# EAGLE design Pi_Tracker2 (EAGLE 6.5.0)
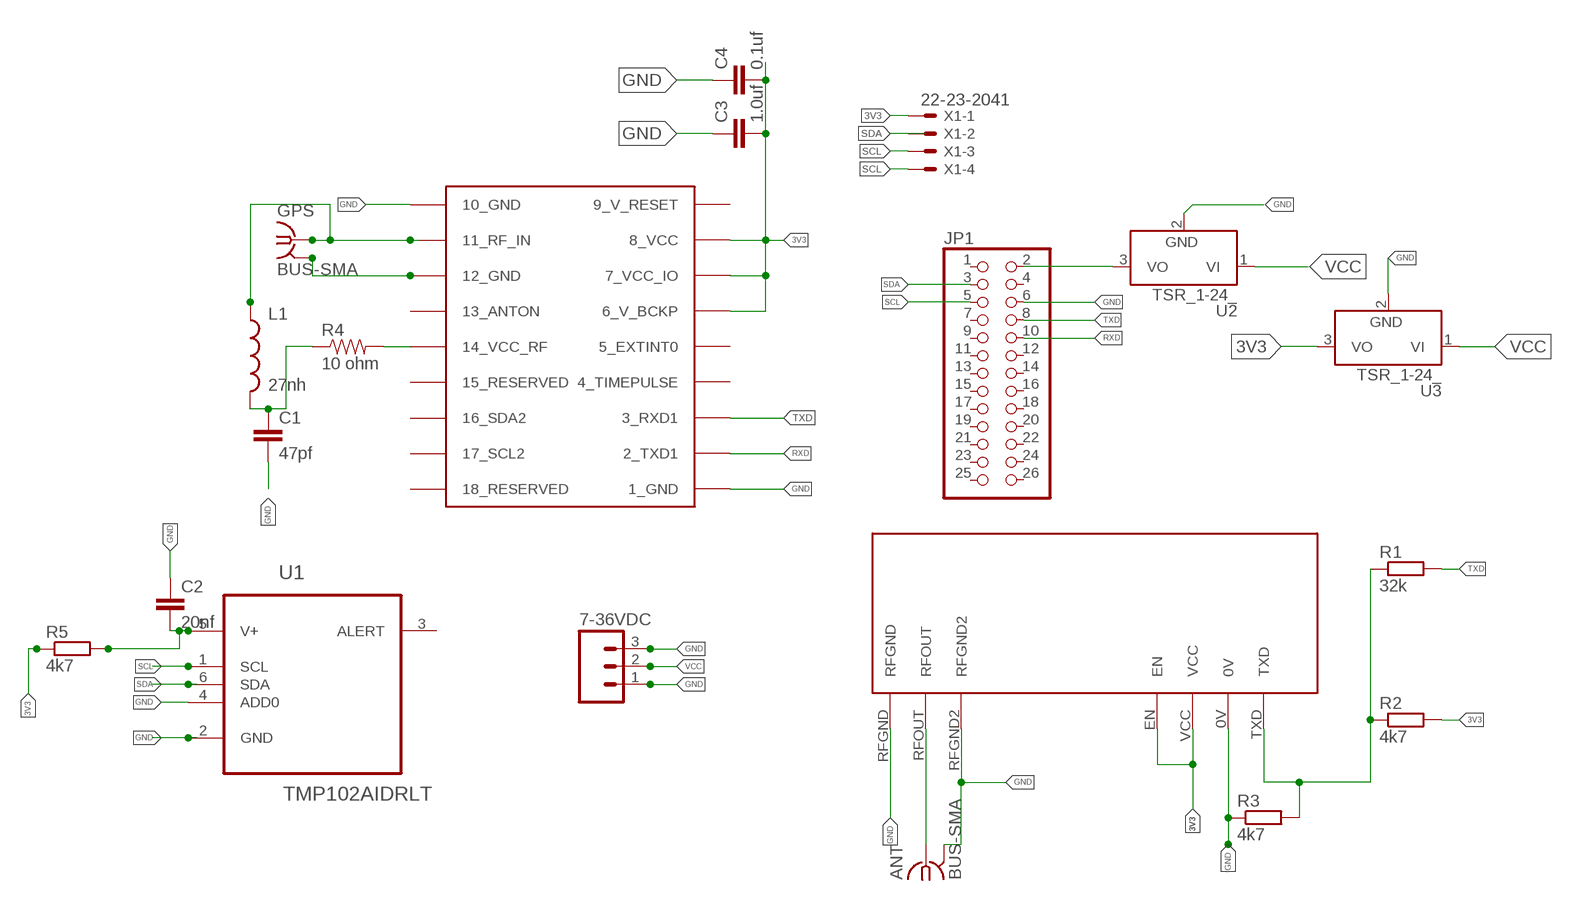
[diagram p0: schematic, sheet 1]

## Parts
7-36VDC  M03PTH  [1X03]
ANT  BUS-SMA  [BUS-SMA]
C1  47pf  CAP0603-CAP  [0603-CAP]
C2  20nf  C-EUC0603  [C0603]
C3  1.0uf  C-EUC0603  [C0603]
C4  0.1uf  C-EUC0603  [C0603]
GPS  BUS-SMA  [BUS-SMA]
JP1  PINHD-2X13  [2X13]
L1  27nh  INDUCTOR0603  [0603]
R1  32k  R-EU_R0603  [R0603]
R2  4k7  R-EU_R0603  [R0603]
R3  4k7  R-EU_R0603  [R0603]
R4  10 ohm  RESISTOR0603  [0603-RES]
R5  4k7  R-EU_R0603  [R0603]
U1  TMP102AIDRLT  [SOT50P160X60-6N]
U2  TSR_1-24_  [TSR-1]
U3  TSR_1-24_  [TSR-1]
U$1  NTX2  [NTX2]
U$2  UBLOX_MAX  [UBLOX_MAX]
X1  22-23-2041  [22-23-2041]

## Nets
3V3: C2.2 C3.2 C4.2 R2.2 R5.1 R5.2 U1.5(V+) U3.3(VO) U$1.EN U$1.VCC U$2.6_V_BCKP U$2.7_VCC_IO U$2.8_VCC X1.1
GND: 7-36VDC.1 7-36VDC.3 ANT.2(GND) ANT.3(GND) ANT.4(GND) ANT.5(GND) C1.2 C2.1 C3.1 C4.1 GPS.2(GND) GPS.3(GND) GPS.4(GND) GPS.5(GND) JP1.6 R3.1 U1.2(GND) U1.4(ADD0) U2.2(GND) U3.2(GND) U$1.0V U$1.RFGND U$1.RFGND2 U$2.1_GND U$2.10_GND U$2.12_GND X1.4
N$2: R4.2 U$2.14_VCC_RF
N$3: C1.1 L1.2 R4.1
N$6: R1.1 R2.1 R3.2 U$1.TXD
N$7: JP1.2 U2.3(VO)
N$9: ANT.1 U$1.RFOUT
N$13: GPS.1 L1.1 U$2.11_RF_IN
RXD: JP1.10 U$2.2_TXD1
SCL: JP1.5 U1.1(SCL) X1.3
SDA: JP1.3 U1.6(SDA) X1.2
TXD: JP1.8 R1.2 U$2.3_RXD1
VCC: 7-36VDC.2 U2.1(VI) U3.1(VI)
Unconnected: JP1.1 JP1.4 JP1.7 JP1.9 JP1.11 JP1.12 JP1.13 JP1.14 JP1.15 JP1.16 JP1.17 JP1.18 JP1.19 JP1.20 JP1.21 JP1.22 JP1.23 JP1.24 JP1.25 JP1.26 U1.3(ALERT) U$2.4_TIMEPULSE U$2.5_EXTINT0 U$2.13_ANTON U$2.15_RESERVED U$2.16_SDA2 U$2.17_SCL2 U$2.18_RESERVED

## Power pins joined to a net without a drawn wire
9_V_RESET: U$2.9_V_RESET

## Library data of the parts
7-36VDC = SparkFun-Connectors:M03: Header 3 Standard 3-pin 0.1" header. Use with straight break away headers (SKU : PRT-00116), right angle break away headers (PRT-00553), swiss pins (PRT-00743), machine pins (PRT-00117), and female headers (PRT-00115). Molex polarized connector foot print use with SKU : PRT-08232 with associated crimp pins and housings.
ANT GPS = Ava:BUS-SMA
C1 = SparkFun-Capacitors:CAP: Capacitor Standard 0603 ceramic capacitor, and 0.1" leaded capacitor.
C2-C4 = rcl:C-EU: CAPACITOR, European symbol
JP1 = pinhead:PINHD-2X13: PIN HEADER
L1 = SparkFun-Passives:INDUCTOR: Inductors Basic Inductor/Choke - 0603 and 1206. Footprints are not proven and vary greatly between part numbers. SRN6045- 33uH, 20% 1.4A SDR0403-560KL - 56uH, 10%, 500mA RMS/740mA peak
R1-R3 R5 = rcl:R-EU_: RESISTOR, European symbol
R4 = SparkFun-Resistors:RESISTOR: Resistor Basic schematic elements and footprints for 0603, 1206, and PTH resistors.
U1 = Ava:TMP102AIDRLT: Temperature Sensor; MPN: TMP102AIDRLT; OC_FARNELL: 1652477; OC_NEWARK: 53M3987; PACKAGE: SOT-23-6; SUPPLIER: Texas Instruments
U2 U3 = traco_tsr-1:TSR_1-*: TRACO TSR-1 Series Point-of-Load DC/DC-Converters Vi max. 36 V; Vo = (1.2 .. 15)V ±2%; Io = 0 .. 1 A SIP-Package (drop-in replacement for 78xx linear voltage regulators in TO220-package, vertically assembled) Source: www.tracopower.com Technologies: TSR 1- Vi (V) Vo (V) ±2% Io = 0 .. 1 A 24_ ( generic ) 2412 4.6 .. 36 1.2 2415 4.6 .. 36 1.5 2418 4.6 .. 36 1.8 2425 4.6 .. 36 2.5 2433 4.75.. 36 3.3 2450 6.5 .. 36 5.0 2465 9.0 .. 36 6.5 2490 12 .. 36 9.0 24120 15 .. 36 12 24150 18 .. 36 15 Author: Dipl.-Ing. FH Rainer Bayer HHN Hochschule Heilbronn, rainer.bayer@hs-heilbronn.de IngenieurbÃ¼ro ing-rb, mail@ing-rb.de
U$1 = Ava:NTX2: Radiometrix NTX2 Transmitter Module Author Anthony Stirk / http://ava.upuaut.net
U$2 = Ava:UBLOX_MAX: UBLOX MAX
X1 = con-molex:22-23-2041: .100" (2.54mm) Center Header - 4 Pin; MF: MOLEX; MPN: 22-23-2041; OC_FARNELL: 1462920; OC_NEWARK: 38C0355

## Net classes
0 default: clearance 0.205 mm

## Board
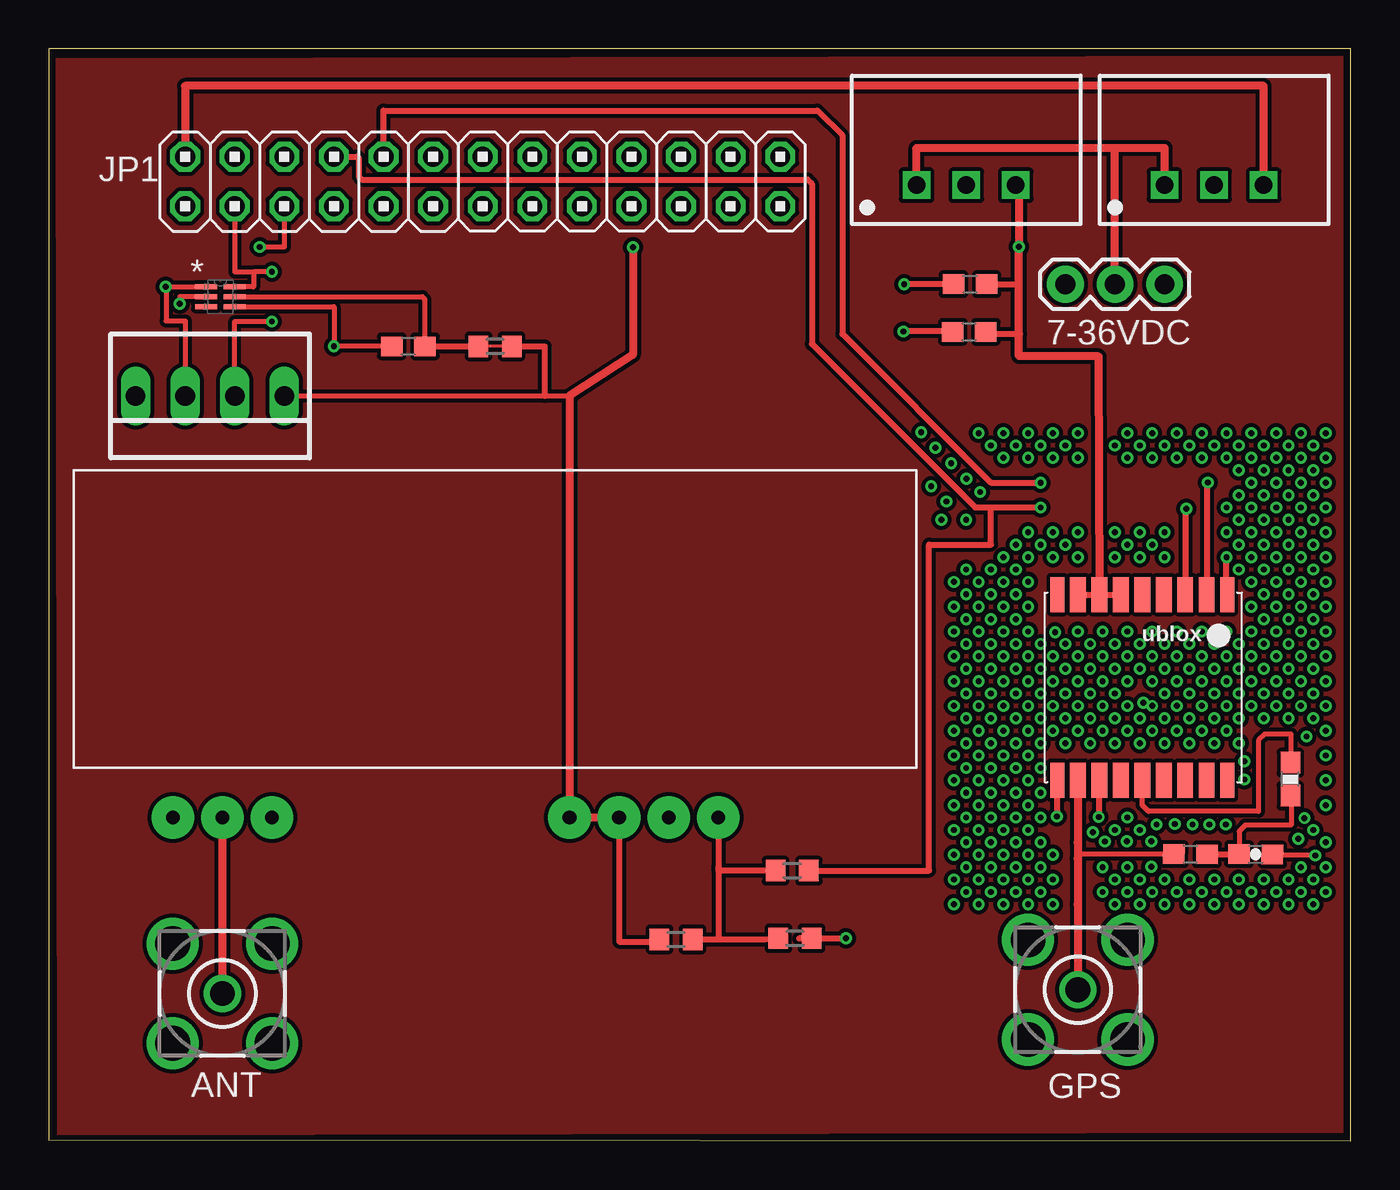
[diagram p1: board, top side]
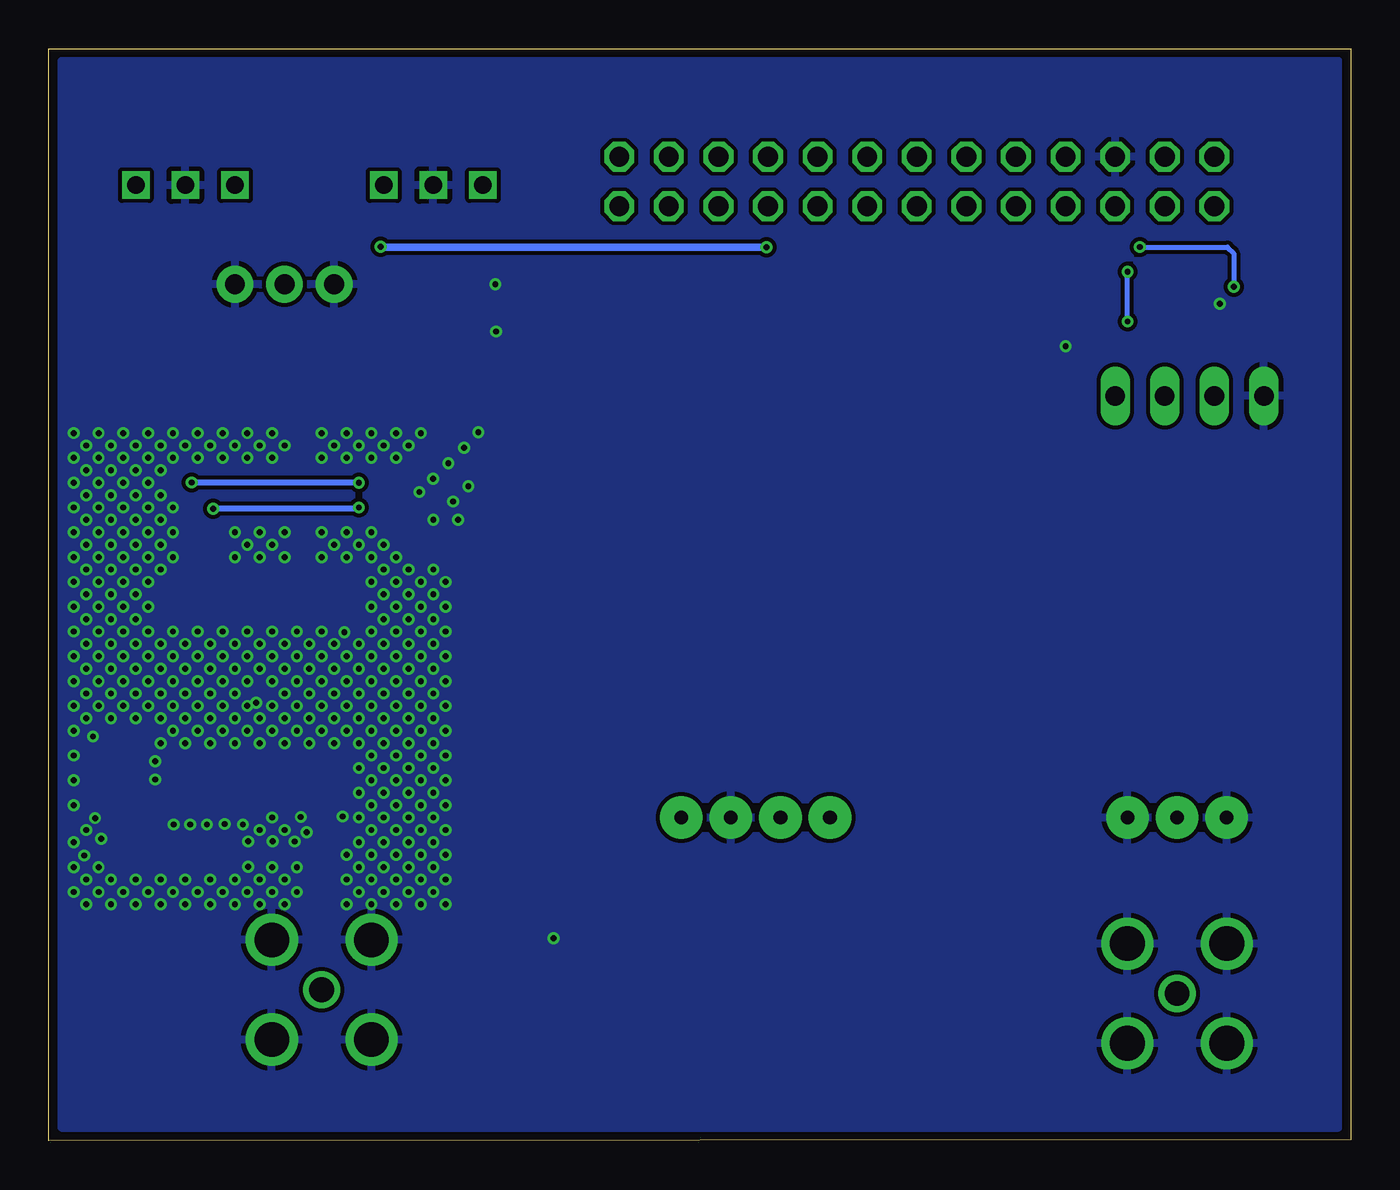
[diagram p2: board, bottom side, seen from below]

Size 66.68 x 55.91 mm. Coordinates in mm from the lower left corner, seen from the top.
Outline: 0,0.04 66.67,0 66.68,55.91 0,55.91 0,0.04
Copper layers (1*16): Top 0.035mm / dielectric 1.5mm / Bottom 0.035mm
Design rules "hackvana": minimum track width 6mil, minimum drill 0.3mm, track to track 6mil, track to pad 6mil, pad to pad 6mil, via to via 6mil, smd to smd 0mil, copper to edge 6mil, drill to drill 6mil, minimum pad ring 10mil, minimum via ring 6mil, stop-mask expansion 2mil, vias tented up to drill 100mil, thermal gap 10mil

### Footprints (pad centres in the part's own frame; a part is rotated, then mirrored left to right if it is on the bottom)
1X03 = drill 1.016 pad 1.88: 1 0,0; 2 2.54,0; 3 5.08,0
BUS-SMA = drill 1.27: 1 0,0 | drill 1.778: 2 -2.55,2.55; 3 2.55,2.55; 4 2.55,-2.55; 5 -2.55,-2.55
0603-CAP = smd 1.1 x 1: 1 -0.85,0; 2 0.85,0
C0603 = smd 1.1 x 1: 1 -0.85,0; 2 0.85,0
2X13 = drill 1.016 octagon: 1 -15.24,-1.27; 2 -15.24,1.27; 3 -12.7,-1.27; 4 -12.7,1.27; 5 -10.16,-1.27; 6 -10.16,1.27; 7 -7.62,-1.27; 8 -7.62,1.27; 9 -5.08,-1.27; 10 -5.08,1.27; 11 -2.54,-1.27; 12 -2.54,1.27; 13 0,-1.27; 14 0,1.27; 15 2.54,-1.27; 16 2.54,1.27; 17 5.08,-1.27; 18 5.08,1.27; 19 7.62,-1.27; 20 7.62,1.27; 21 10.16,-1.27; 22 10.16,1.27; 23 12.7,-1.27; 24 12.7,1.27; 25 15.24,-1.27; 26 15.24,1.27
0603 = smd 1.1 x 1: 1 -0.85,0; 2 0.85,0
R0603 = smd 1 x 1.1: 1 -0.85,0; 2 0.85,0
0603-RES = smd 1.1 x 1: 1 -0.85,0; 2 0.85,0
SOT50P160X60-6N = smd 1.118 x 0.254: 1 -0.737,0.508; 2 -0.737,0; 3 -0.737,-0.508; 4 0.737,-0.508; 5 0.737,0; 6 0.737,0.508
TSR-1 = drill 0.9 square: 1 -2.54,0; 2 0,0; 3 2.54,0
NTX2 = drill 0.7 pad 2.184: 0V -2.54,-10.16; EN -7.62,-10.16; RFGND -22.86,-10.16; RFGND2 -27.94,-10.16; RFOUT -25.4,-10.16; TXD 0,-10.16; VCC -5.08,-10.16
UBLOX_MAX = smd 1.8 x 0.7: 1_GND 4.95,-4.4; 9_V_RESET 4.95,4.3; 10_GND -4.55,4.3; 18_RESERVED -4.55,-4.4 | smd 1.8 x 0.8: 2_TXD1 4.95,-3.35; 3_RXD1 4.95,-2.25; 4_TIMEPULSE 4.95,-1.15; 5_EXTINT0 4.95,-0.05; 6_V_BCKP 4.95,1.05; 7_VCC_IO 4.95,2.15; 8_VCC 4.95,3.25; 11_RF_IN -4.55,3.25; 12_GND -4.55,2.15; 13_ANTON -4.55,1.05; 14_VCC_RF -4.55,-0.05; 15_RESERVED -4.55,-1.15; 16_SDA2 -4.55,-2.25; 17_SCL2 -4.55,-3.35
22-23-2041 = drill 1 long: 1 -3.81,0; 2 -1.27,0; 3 1.27,0; 4 3.81,0

### Placement (x,y rotation side)
7-36VDC  57.15,43.86 180 top
ANT  8.89,7.55 0 top
C1  61.82,14.67 359.2 top
C2  18.41,40.68 0 top
C3  47.15,41.42 0 top
C4  47.19,43.86 0 top
GPS  52.71,7.74 0 top
JP1  22.22,49.12 0 top
L1  58.48,14.68 359.4 top
R1  38.07,13.83 0 top
R2  32.12,10.31 180 top
R3  38.22,10.37 180 top
R4  63.59,18.52 90 top
R5  22.86,40.68 0 top
U1  8.79,43.22 0 top
U2  59.69,48.94 0 top
U3  46.99,48.94 0 top
U$1  34.29,26.71 0 top
U$2  55.96,23.01 90 top
X1  8.26,38.14 180 top

### Tracks (layer width: path | path; a pad name or v marks a point on that pad's centre or on a via)
3V3  (via drill 0.3)
  Top 0.152: R5.2 R5.1
  Top 0.254: U1.5 19.12,43.22 19.26,43.09 C2.2 | X1.1 25.4,38.14 26.67,38.14
  Top 0.305: U$2.6_V_BCKP U$2.7_VCC_IO U$2.8_VCC | 25.4,38.14 25.4,40.68 R5.2 | C3.2 48.09,41.32 49.69,41.32 | C4.2 | C4.2 49.69,43.86 | U$1.VCC 29.21,10.2 31.27,10.2 R2.2 | C2.2 R5.1
  Top 0.406: U$1.VCC U$1.EN 26.67,38.14 29.91,40.24 v29.92,45.76 | U$2.7_VCC_IO 53.77,40.17 49.7,40.17 49.69,41.32 49.69,43.86 v49.68,45.78 49.68,48.94 U3.3
  Bottom 0.406: v49.68,45.78 v29.92,45.76
GND  (via drill 0.3)
  Top 0.254: C2.1 v14.61,40.68 14.61,42.71 U1.4 | U$2.10_GND | U$2.12_GND 53.77,18.43 | C1.2 64.9,14.66 64.93,14.63 | U1.2 6.71,43.22 v6.71,42.86
  Top 0.305: R3.1 38.44,10.37 v40.83,10.37 | 60.33,28 U$2.1_GND 60.33,27.96 v60.33,29.89 | C4.1 v43.82,43.86 | C3.1 46.27,41.44 v43.77,41.44 | U$2.10_GND 51.63,18.46 v51.63,16.6 | 53.77,18.43 v53.77,16.58 | 64.9,14.66 64.88,14.66 v64.88,14.61
  other vias: 51.54,26.04 52.71,26.08 53.98,26.08 55.25,26.08 56.52,26.08 57.79,26.08 59.05,26.08 60.33,26.08 61.59,26.08 62.87,26.08 64.13,26.08 65.41,26.08 65.41,24.81 64.13,24.81 62.87,24.81 61.59,24.81 60.33,24.81 59.05,24.81 57.79,24.81 56.52,24.81 55.25,24.81 53.98,24.81 52.71,24.81 51.44,24.81 50.16,24.81 48.9,24.81 47.62,24.81 47.62,26.08 48.9,26.08 50.16,26.08 50.16,27.35 48.9,27.35 47.62,27.35 47.62,28.62 48.9,28.62 50.16,28.62 47.62,23.54 48.9,23.54 50.16,23.54 51.44,23.54 52.71,23.54 53.98,23.54 55.25,23.54 56.52,23.54 57.79,23.54 59.05,23.54 60.33,23.54 61.59,23.54 62.87,23.54 64.13,23.54 65.41,23.54 47.62,22.27 48.9,22.27 50.16,22.27 51.44,22.27 52.71,22.27 53.98,22.27 55.25,22.27 56.52,22.27 57.79,22.27 59.05,22.27 60.33,22.27 61.59,22.27 62.87,22.27 64.13,22.27 65.41,22.27 61.59,27.35 62.87,27.35 64.13,27.35 65.41,27.35 61.59,28.62 62.87,28.62 64.13,28.62 65.41,28.62 47.62,21 48.9,21 50.16,21 51.44,21 52.71,21 53.98,21 55.25,21 56.52,21 57.79,21 59.05,21 60.33,21 65.41,21 47.62,19.73 48.9,19.73 50.16,19.73 47.62,18.46 48.9,18.46 50.16,18.46 47.62,17.19 48.9,17.19 50.16,17.19 47.62,15.92 48.9,15.92 47.62,14.65 48.9,14.65 55.25,16.55 54.61,15.92 55.88,15.92 64.77,15.92 65.41,19.73 65.41,18.46 65.41,17.19 57.79,12.74 59.05,12.74 60.33,12.74 61.59,12.74 62.87,12.74 64.13,12.74 65.41,12.74 47.62,13.38 55.88,20.36 57.15,20.36 58.42,20.36 59.69,20.36 54.61,20.36 53.34,20.36 52.07,20.36 52.07,21.63 53.34,21.63 54.61,21.63 55.88,21.63 57.15,21.63 58.42,21.63 59.69,21.63 59.69,22.9 58.42,22.9 57.15,22.9 56.06,22.43 54.61,22.9 53.34,22.9 52.07,22.9 52.07,24.17 53.34,24.17 54.61,24.17 55.88,24.17 57.15,24.17 58.42,24.17 59.69,24.17 52.07,25.44 53.34,25.44 54.61,25.44 55.88,25.44 57.15,25.44 58.42,25.44 59.69,25.44 48.26,26.71 48.26,27.98 48.26,25.44 48.26,24.17 48.26,22.9 48.26,21.63 48.26,20.36 48.26,19.09 48.26,17.82 48.26,16.55 48.26,15.28 48.26,14.01 49.53,15.28 49.53,16.55 49.53,17.82 49.53,19.09 49.53,20.36 49.53,21.63 49.53,22.9 49.53,24.17 49.53,25.44 49.53,26.71 49.53,27.98 50.8,25.44 50.8,24.17 50.8,22.9 50.8,21.63 50.8,20.36 50.8,19.09 50.8,17.82 62.23,27.98 62.23,26.71 62.23,25.44 62.23,24.17 62.23,22.9 62.23,21.63 63.5,21.63 63.5,22.9 63.5,24.17 63.5,25.44 63.5,26.71 63.5,27.98 64.77,27.98 64.77,26.71 64.77,25.44 64.77,24.17 64.77,22.9 64.77,21.63 65.41,15.28 64.77,13.38 60.96,20.36 60.96,25.44 60.96,24.17 60.96,22.9 60.96,21.63 62.23,29.25 63.5,29.25 64.77,29.25 46.99,27.98 46.99,26.71 46.99,25.44 46.99,24.17 46.99,22.9 46.99,21.63 46.99,20.36 46.99,19.09 46.99,17.82 46.99,16.55 46.99,15.28 46.99,14.01 46.36,13.38 46.36,14.65 46.36,15.92 46.36,17.19 46.36,18.46 46.36,19.73 46.36,21 46.36,22.27 46.36,23.54 46.36,24.81 46.36,26.08 46.36,27.35 46.36,28.62 53.47,15.79 55.22,15.33 56.74,16.19 57.68,16.22 58.59,16.19 59.45,16.19 60.28,16.19 61.23,18.5 61.23,19.44 64.42,20.7 63.99,15.47 64.31,16.52 56.47,15.33 54.08,15.33 64.13,14.01 63.5,13.38 60.96,13.38 62.23,13.38 59.69,13.38 58.42,13.38 57.15,13.38 56.47,14.04 50.16,15.92 50.8,16.55 48.9,13.38 49.53,14.01 50.16,13.38 50.16,14.65 50.8,15.28 50.8,14.01 51.44,13.38 51.44,14.65 55.25,14.01 55.88,13.38 54.61,13.38 53.98,14.01 56.52,12.74 55.25,12.74 53.98,12.74 54.61,12.11 55.88,12.11 57.15,12.11 58.42,12.11 59.69,12.11 60.96,12.11 62.23,12.11 63.5,12.11 64.77,12.11 65.41,14.01 48.26,12.74 50.16,12.11 51.44,12.11 50.8,12.74 49.53,12.74 46.99,12.74 60.96,29.25 46.99,29.25 49.53,29.25 48.26,29.25 48.9,29.89 50.16,29.89 49.53,30.52 50.8,30.52 50.16,31.16 51.44,29.89 52.07,30.52 51.44,31.16 52.71,29.89 52.71,31.16 54.61,31.16 54.61,29.89 55.25,30.52 55.88,31.16 55.88,29.89 57.15,31.16 56.52,30.52 57.15,29.89 61.59,29.89 62.87,29.89 64.13,29.89 60.96,30.52 62.23,30.52 63.5,30.52 64.77,30.52 65.41,29.89 65.41,31.16 65.41,32.43 65.41,33.7 48.9,34.97 50.16,34.97 51.44,34.97 52.71,34.97 55.25,34.97 56.52,34.97 57.79,34.97 59.05,34.97 60.33,34.97 61.59,34.97 62.87,34.97 64.13,34.97 65.41,34.97 64.77,34.33 64.77,33.06 64.77,31.79 64.13,33.7 64.13,32.43 64.13,31.16 63.5,31.79 63.5,33.06 63.5,34.33 62.87,33.7 62.87,32.43 62.87,31.16 62.23,31.79 62.23,33.06 62.23,34.33 61.59,33.7 61.59,32.43 61.59,31.16 60.96,31.79 60.96,33.06 60.96,34.33 60.33,31.16 60.33,32.43 46.99,31.79 45.72,31.79 45.2,33.51 49.53,35.6 48.26,35.6 50.8,35.6 52.07,35.6 52.71,36.24 51.44,36.24 50.16,36.24 48.9,36.24 47.62,36.24 55.88,35.6 55.25,36.24 57.15,35.6 56.52,36.24 57.79,36.24 58.42,35.6 59.69,35.6 60.96,35.6 62.23,35.6 63.5,35.6 64.77,35.6 59.05,36.24 60.33,36.24 61.59,36.24 62.87,36.24 64.13,36.24 65.41,36.24 45.42,35.49 46.22,34.69 46.99,33.89 47.7,33.22 44.68,36.28 45.98,32.74 48.9,12.11 47.62,12.11 46.36,12.11 54.61,35.6
  pour Bottom: 0.64,55.29 66.04,55.29 66.04,0.68 0.64,0.68
N$1
  pour Top: 0.35,55.42 0.44,0.29 66.3,0.41 66.3,55.55
N$2
  Top 0.254: R4.2 63.63,19.41 63.63,20.82 62.28,20.82 61.96,20.5 61.96,16.87 56.33,16.87 56.01,17.19 U$2.14_VCC_RF
N$3
  Top 0.254: R4.1 63.63,17.62 63.63,16.16 61.29,16.16 60.97,15.84 C1.1
  Top 0.305: C1.1 60.8,14.68 60.8,14.64 | 60.8,14.64 61,14.64 | 60.8,14.64 59.33,14.64 L1.2 | R4.1
N$6
  Top 0.305: R2.1 34.29,10.31 | 34.29,10.31 36.67,10.31 R3.2 | U$1.TXD 34.29,14.01 34.29,13.83 | 34.29,13.83 34.29,10.31 | R1.1 34.29,13.83
N$7
  Top 0.406: U2.3 62.23,54.02 6.99,54.02 JP1.2
N$9
  Top 0.406: U$1.RFOUT ANT.1
N$13
  Top 0.254: 52.71,14.69 L1.1
  Top 0.305: 52.76,12.03 52.71,12.09 | 52.71,14.69 52.71,15.28
  Top 0.406: U$2.11_RF_IN 52.71,15.28 52.71,14.44 52.71,12.09 GPS.1
RXD  (via drill 0.3)
  Top 0.305: JP1.10 17.14,52.75 39.37,52.75 40.64,51.48 40.64,41.32 48.26,33.7 v50.8,33.7 | 59.2,28.07 U$2.2_TXD1 59.31,33.64 v59.37,33.71
  Bottom 0.305: v50.8,33.7 50.81,33.71 v59.37,33.71
SCL  (via drill 0.3)
  Top 0.254: JP1.5 12.06,45.76 v10.79,45.76 | U1.1 v5.99,43.74 6.01,43.74 6.01,41.98 7,41.98 7,41.94 6.99,41.94 X1.3
  Bottom 0.254: v10.79,45.76 6.31,45.76 5.99,45.44 v5.99,43.74
SDA  (via drill 0.3)
  Top 0.254: JP1.3 9.53,44.49 10.16,44.49 10.49,44.49 | 10.49,44.49 10.49,43.72 U1.6 | X1.2 9.53,41.95 v11.43,41.95 | v11.43,44.49 10.49,44.49
  Top 0.406: JP1.3
  Bottom 0.254: v11.43,41.95 v11.43,44.49
TXD  (via drill 0.3)
  Top 0.305: 58.1,28.07 U$2.3_RXD1 | R1.2 45.09,13.83 45.09,30.52 48.26,30.52 48.26,32.43 | JP1.8 15.82,50.39 15.88,50.33 15.88,49.36 16.03,49.21 38.86,49.21 39.08,48.99 39.08,40.8 47.46,32.43 48.26,32.43 | 58.09,28.09 U$2.3_RXD1 | 48.26,32.43 v50.8,32.43 | v58.26,32.36 58.21,32.31 U$2.3_RXD1
  Top 0.406: 58.16,28.01 U$2.3_RXD1
  Bottom 0.305: v50.8,32.43 50.87,32.36 v58.26,32.36
VCC
  Top 0.406: 7-36VDC.2 54.61,50.84 | 54.61,50.84 55.25,50.84 57.15,50.84 U2.1 | U3.1 44.45,50.84 54.61,50.84